# Altium schematic sheet 19V_Converter.SchDoc
size A; SheetNumber: 7; SheetTotal: 9
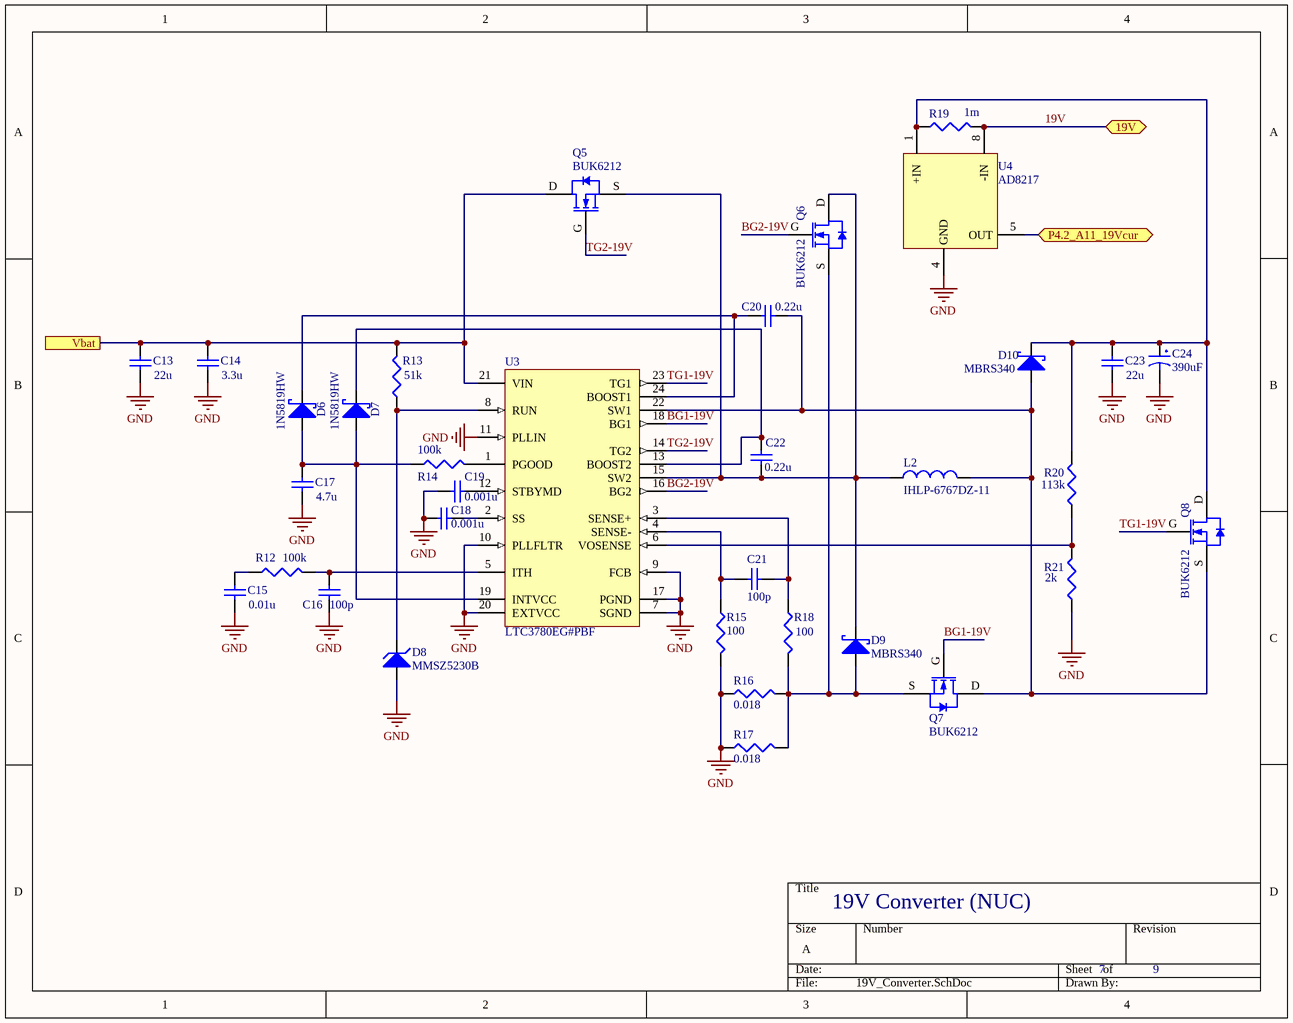
[diagram p0: 19V_Converter.SchDoc]

## Parts
C13  value 22u  [C1206]  (hidden comment: Cap Semi)
C14  value 3.3u  [C1206]  (hidden comment: Cap Semi)
C15  value 0.01u  [C1206]  (hidden comment: Cap Semi)
C16  value 100p  [C1206]  (hidden comment: Cap Semi)
C17  value 4.7u  [C1206]  (hidden comment: Cap Semi)
C18  value 0.001u  [C1206]  (hidden comment: Cap Semi)
C19  value 0.001u  [C1206]  (hidden comment: Cap Semi)
C20  value 0.22u  [C1206]  (hidden comment: Cap Semi)
C21  value 100p  [C1206]  (hidden comment: Cap Semi)
C22  value 0.22u  [C1206]  (hidden comment: Cap Semi)
C23  value 22u  [C1206]  (hidden comment: Cap Semi)
C24  390uF  [PCVxxxxxMCLxGS]
D6  1N5819HW  [1N58xx]
D7  1N5819HW  [1N58xx]
D8  MMSZ5230B  [ONSC-SOD-123-2-425-04_V]
D9  MBRS340  [MBRS340]
D10  MBRS340  [MBRS340]
L2  IHLP-6767DZ-11  [IHLP-6767DZ-11]
Q5  BUK6212  [NXP-SOT428_M]
Q6  BUK6212  [NXP-SOT428_M]
Q7  BUK6212  [NXP-SOT428_M]
Q8  BUK6212  [NXP-SOT428_M]
R12  value 100k  [J1-0603]  (hidden comment: Res3)
R13  value 51k  [J1-0603]  (hidden comment: Res3)
R14  value 100k  [J1-0603]  (hidden comment: Res3)
R15  value 100  [J1-0603]  (hidden comment: Res3)
R16  value 0.018  [R1206]  (hidden comment: Res3)
R17  value 0.018  [R1206]  (hidden comment: Res3)
R18  value 100  [J1-0603]  (hidden comment: Res3)
R19  value 1m  [14-1210]  (hidden comment: Res3)
R20  value 113k  [J1-0603]  (hidden comment: Res3)
R21  value 2k  [J1-0603]  (hidden comment: Res3)
U3  LTC3780EG#PBF  [LT-G-24_L]
U4  AD8217  [AD8217]

## Ports
19V (bidir), P4.2_A11_19Vcur (bidir), Vbat

## Nets
GND: C13.1 C14.1 C15.1 C16.1 C17.1 C18.1 C19.1 C23.1 C24.2 D8.2(A) R15.2 R16.1 R17.1 R21.1 U3.7(SGND) U3.9(FCB) U3.10(PLLFLTR) U3.11(PLLIN) U3.17(PGND) U3.20(EXTVCC) U4.4(GND)
19V: R19.2 U4.8(-IN) ; port 19V
BG1-19V: Q7.G U3.18(BG1)
BG2-19V: Q6.G U3.16(BG2)
P4.2_A11_19Vcur: U4.5(OUT) ; port P4.2_A11_19Vcur
TG1-19V: Q8.G U3.23(TG1)
TG2-19V: Q5.G U3.14(TG2)
Vbat: C13.2 C14.2 Q5.D R13.2 U3.21(VIN) ; port Vbat
NetC15_2: C15.2 R12.1
NetC16_2: C16.2 R12.2 U3.5(ITH)
NetC17_2: C17.2 D6.A(Anode) D7.A(Anode) R14.1 U3.19(INTVCC)
NetC18_2: C18.2 U3.2(SS)
NetC19_2: C19.2 U3.12(STBYMD)
NetC20_1: C20.1 D10.A(Anode) L2.2 Q7.D Q8.S U3.22(SW1)
NetC20_2: C20.2 D6.K(Cathode) U3.24(BOOST1)
NetC21_1: C21.1 R15.1 U3.4(SENSE-)
NetC21_2: C21.2 R18.1 U3.3(SENSE+)
NetC22_1: C22.1 D9.K(Cathode) L2.1 Q5.S Q6.D U3.15(SW2)
NetC22_2: C22.2 D7.K(Cathode) U3.13(BOOST2)
NetC23_2: C23.2 C24.1 D10.K(Cathode) Q8.D R19.1 R20.2 U4.1(+IN)
NetD8_1: D8.1(K) R13.1 U3.8(RUN)
NetD9_A: D9.A(Anode) Q6.S Q7.S R16.2 R17.2 R18.2
NetR14_2: R14.2 U3.1(PGOOD)
NetR20_1: R20.1 R21.2 U3.6(VOSENSE)

## Notes on the sheet
- 19V Converter (NUC)

## Library data of the parts
C13-C23 = Cap Semi: Capacitor (Semiconductor SIM Model); Published: 8-Jun-2000; LatestRevisionDate: 29-May-2009; LatestRevisionNote: IPC-7351 Footprint Added.; PackageReference: C1206; Publisher: Altium Limited; PackageDescription: Chip Capacitor
C24 = PCV1E391MCL2GS: CAP ALUM POLY 390UF 20% 25V SMD; Digikey: https://www.digikey.com/product-detail/en/nichicon/PCV1E391MCL2GS/493-4544-1-ND/2786841; Datasheet: http://nichicon-us.com/english/products/pdfs/e-pcv.pdf
D6 D7 = 1N58xx: 1A Schottky Barrier Rectifier Diode; Datasheet: http://www.kesenes.com/pdf/1n5817-1n5819.pdf
D8 = MMSZ5230BT1G: Zener Voltage Regulator, 500 mW, 2-Pin SOD-123, Pb-Free, Tape and Reel; Manufacturer: On Semiconductor; P Max (W): 0.5; VZ Typ (V): 4.7; DatasheetVersion: Rev. 12; PackageVersion: Rev. G, 10/2009; PackageReference: SOD-123-2-425-04; PackageDescription: 2-Pin SOD, Body 1.6 x 2.69 mm; Supplier 1: Digi-Key; Supplier Part Number 1: MMSZ5230BT1GOSTR-ND; Supplier 2: Digi-Key; Supplier Part Number 2: MMSZ5230BT1GOSCT-ND; Supplier 3: Digi-Key; Supplier Part Number 3: MMSZ5230BT1GOSDKR-ND; Supplier 4: Farnell; Supplier Part Number 4: 1431272; Supplier 5: Farnell; Supplier Part Number 5: 1431272RL; Supplier 6: Farnell; Supplier Part Number 6: 2370826; Supplier 7: Newark; Supplier Part Number 7: 83H7423; Supplier 8: Newark; Supplier Part Number 8: 67R1368; Supplier 9: Mouser; Supplier Part Number 9: 863-MMSZ5230BT1G; Packing: Tape and Reel; RoHS: Pb-Free; Mounting Technology: Surface Mount; PartNumber: MMSZ5230BT1G; ComponentLink1Description: Manufacturer URL; ComponentLink1URL: http://www.onsemi.com/; ComponentLink2Description: Datasheet; ComponentLink2URL: http://www.onsemi.com/pub_link/Collateral/MMSZ5221BT1-D.PDF; ComponentLink3Description: Package Specification; ComponentLink3URL: http://www.onsemi.com/pub_link/Collateral/425-04.PDF
D9 D10 = MBRS340: Schottky Rectifier; Datasheet: https://www.mouser.com/ds/2/308/MBRS340-1120985.pdf
L2 = IHLP-6767DZ-11: 15µH Shielded Molded Inductor 14A 14.4 mOhm Max Nonstandard; Datasheet: http://www.vishay.com/docs/34306/lp67dz11.pdf; Digikey: https://www.digikey.com/product-detail/en/vishay-dale/IHLP6767GZER150M11/541-1287-1-ND/2139413
Q5-Q8 = BUK6212: N-Channel TrenchMOS Intermediate Level FET, 40 V, 50 A, 3-Pin SOT428, Tape and Reel; Manufacturer: NXP Semiconductors; PartNumber: BUK6212-40C,118; Automotive Qualified: Y; Channel Type: N; ID [max] (A): 50; IDM [max] (A): 233; Packing: Tape & Reel; Qr [typ] (nC): 38; VDS [max] (V): 40; VGSth [typ] (V): 2.3; DatasheetVersion: Rev. 2; PackageVersion: 14-06-10, 06/2014; PackageReference: SOT428; PackageDescription: 3-Pin Plastic Single-ended Surface Mounted Package, Body 6.1 x 6.6 mm, Pitch 2.285 mm; Supplier 1: Digi-Key; Supplier Part Number 1: 568-6983-2-ND; Supplier 2: Digi-Key; Supplier Part Number 2: 568-6983-1-ND; Supplier 3: Digi-Key; Supplier Part Number 3: 568-6983-6-ND; Supplier 4: Mouser; Supplier Part Number 4: 771-BUK621240C118; Mounting Technology: Surface Mount; Code_JEITA: SC-63; Code_JEDEC: TO-252; ComponentLink1Description: Manufacturer URL; ComponentLink1URL: http://www.nxp.com/; ComponentLink2Description: Datasheet; ComponentLink2URL: http://www.nxp.com/documents/data_sheet/BUK6212-40C.pdf; ComponentLink3Description: Package Specification; ComponentLink3URL: http://www.nxp.com/documents/outline_drawing/sot428_po.pdf
R12-R21 = Res3: Resistor; Published: 8-Jun-2000; LatestRevisionDate: 29-May-2009; LatestRevisionNote: IPC-7351 Footprint Added.; PackageReference: J1-0603; Publisher: Altium Limited; PackageDescription: Chip Resistor
U3 = LTC3780EG#PBF: Buck-boost Controller, Constant Frequency, Current Mode Control with Power Good Output, 24-pin SOP (G-24), -40 to 85 degC, Pb-Free; Manufacturer: Linear Technology; Frequency Sync Range: 200kHz - 400kHz; Number of Outputs: 1; DatasheetVersion: Rev. F; PackageVersion: Jun-10; PackageReference: G-24; PackageDescription: 24-Pin Plastic SSOP, Body 8.2 x 5.3 mm, Pitch 0.65 mm; Supplier 1: Digi-Key; Supplier Part Number 1: LTC3780EG#PBF-ND; Supplier 2: Farnell; Supplier Part Number 2: 1273545; Supplier 3: Newark; Supplier Part Number 3: 56M8395; RoHS: TRUE; Mounting Technology: Surface Mount; PartNumber: LTC3780EG#PBF; ComponentLink1Description: Manufacturer URL; ComponentLink1URL: http://www.linear.com/; ComponentLink2Description: Datasheet; ComponentLink2URL: http://cds.linear.com/docs/en/datasheet/3780ff.pdf; ComponentLink3Description: Package Specification; ComponentLink3URL: http://cds.linear.com/docs/en/packaging/SSOP_24_05-08-1640.pdf
U4 = AD8217: High Resolution, Zero-Drift  Current Shunt Monitor; Datasheet: https://www.analog.com/media/en/technical-documentation/data-sheets/AD8217.pdf